# Altium schematic sheet PP2_USB.SchDoc
size 199 x 119 mm
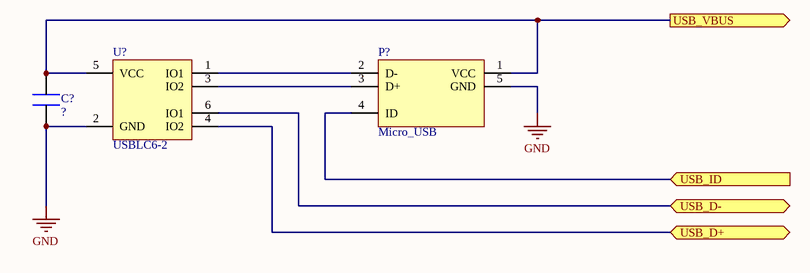
[diagram p0: PP2_USB.SchDoc]

## Parts
C?  Condo  (value not drawn)  (no BOM)
P?  Micro_USB
U?  USBLC6-2

## Ports
USB_D+ (bidir), USB_D- (bidir), USB_ID (in), USB_VBUS (out)

## Nets
GND: C?.1 P?.5(GND) U?.2(GND)
USB_D+: U?.4(IO2) ; port USB_D+
USB_D-: U?.6(IO1) ; port USB_D-
USB_ID: P?.4(ID) ; port USB_ID
USB_VBUS: C?.2 P?.1(VCC) U?.5(VCC) ; port USB_VBUS
NetP?_2: P?.2(D-) U?.1(IO1)
NetP?_3: P?.3(D+) U?.3(IO2)

## Library data of the parts
C? = Condo: Condensateur; Valeur: ?
P? = Micro_USB: Prise Micro USB Femelle
U? = USBLC6-2: Protection_ESD; DataSheet: http://www.st.com/content/ccc/resource/technical/document/datasheet/06/1d/48/9c/6c/20/4a/b2/CD00050750.pdf/files/CD00050750.pdf/jcr:content/translations/en.CD00050750.pdf